# EAGLE design 528_Wio_Terminal_Rev010000 (EAGLE 9.6.2)
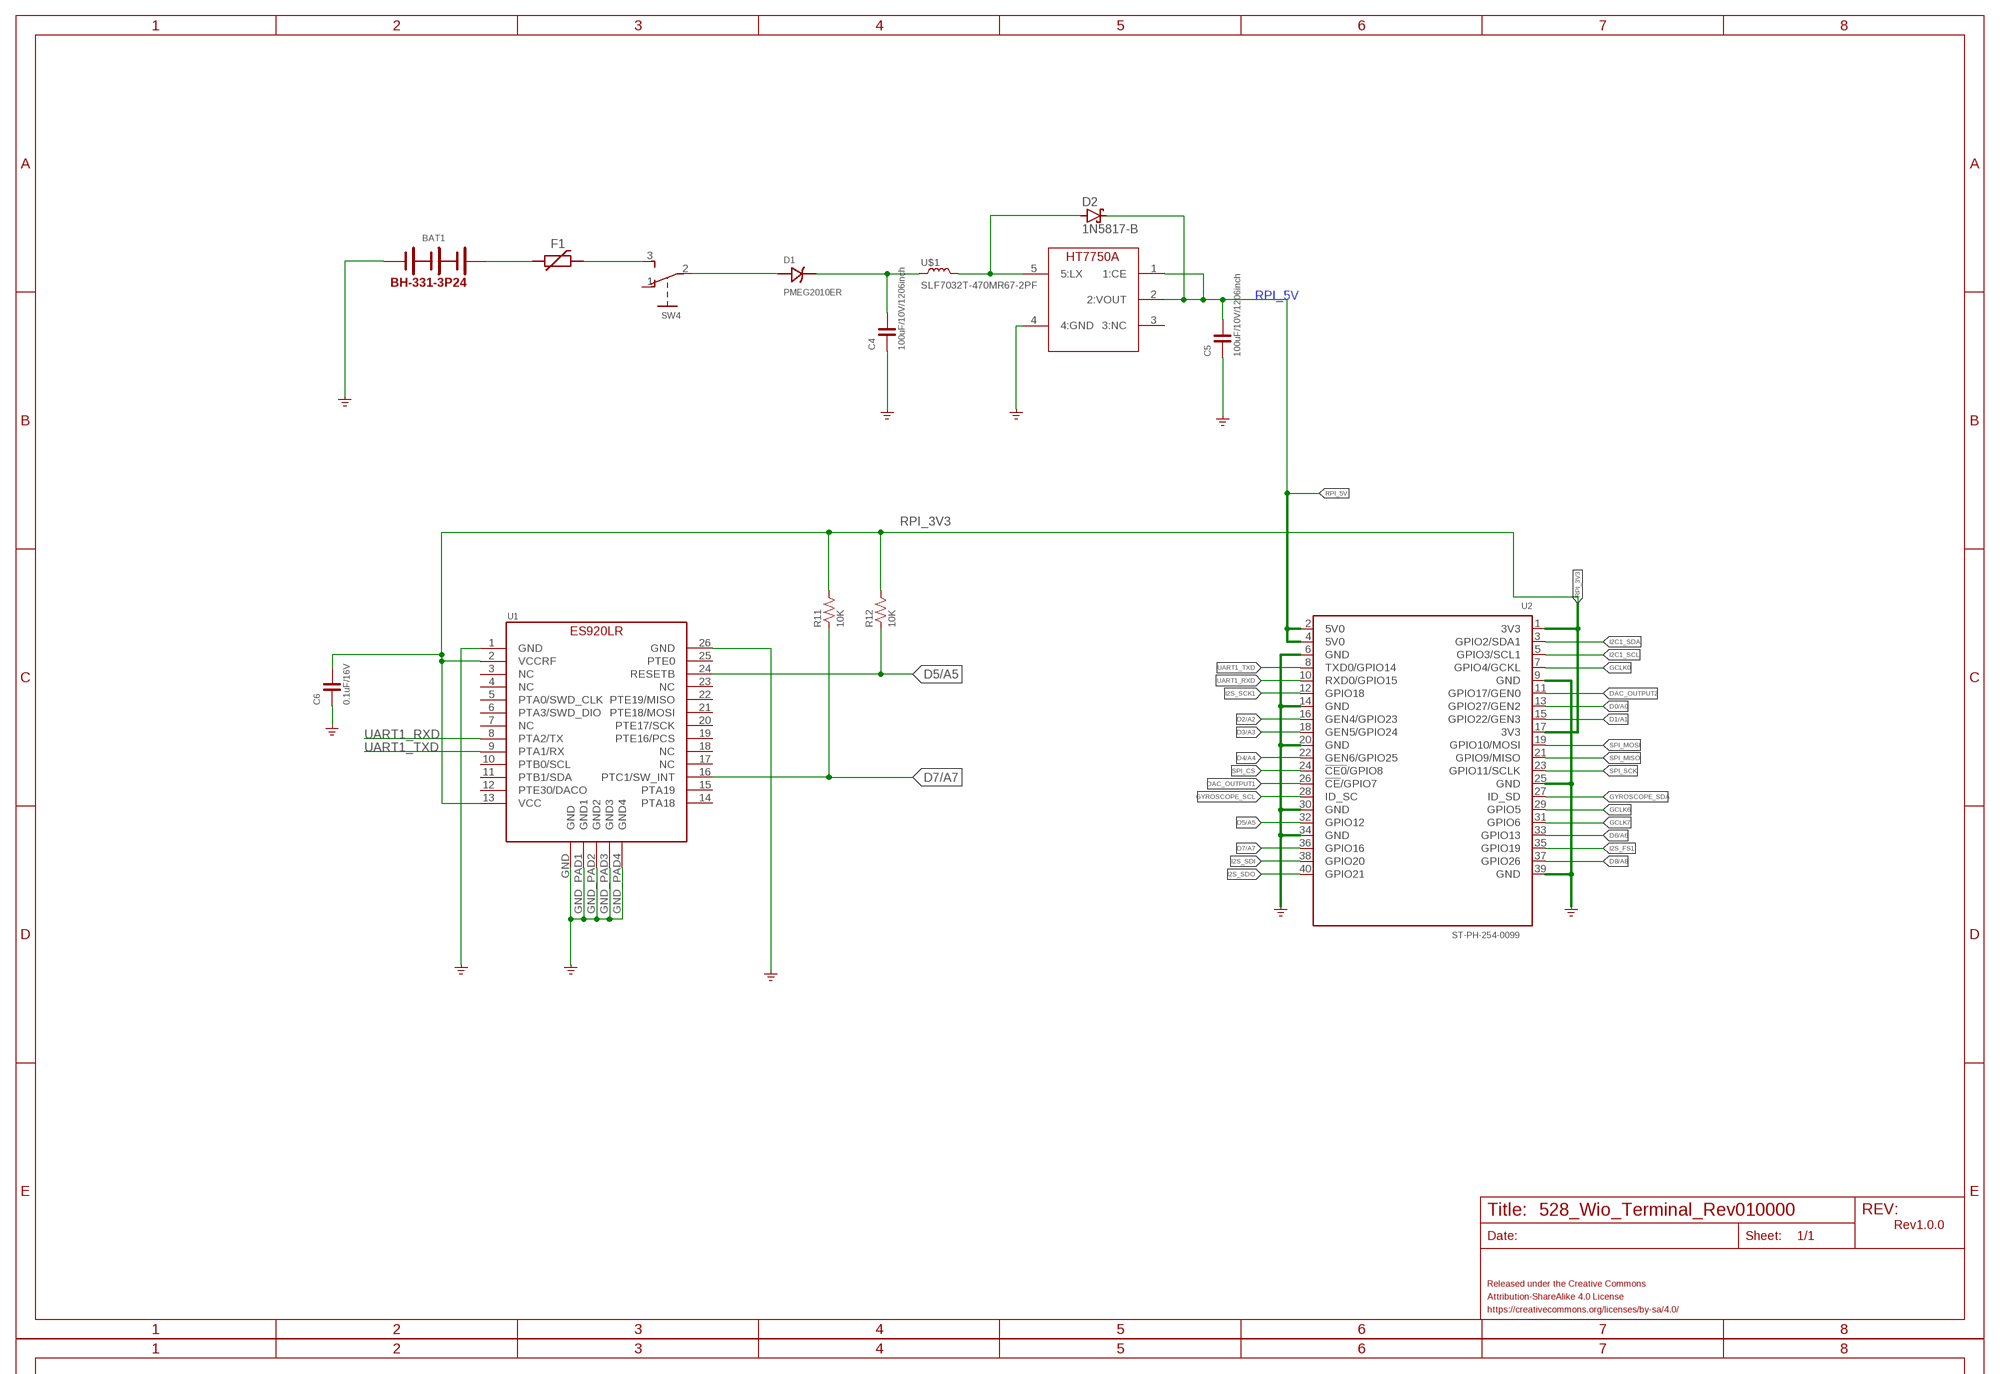
[diagram p0: schematic, sheet 1, part 1 of 2]
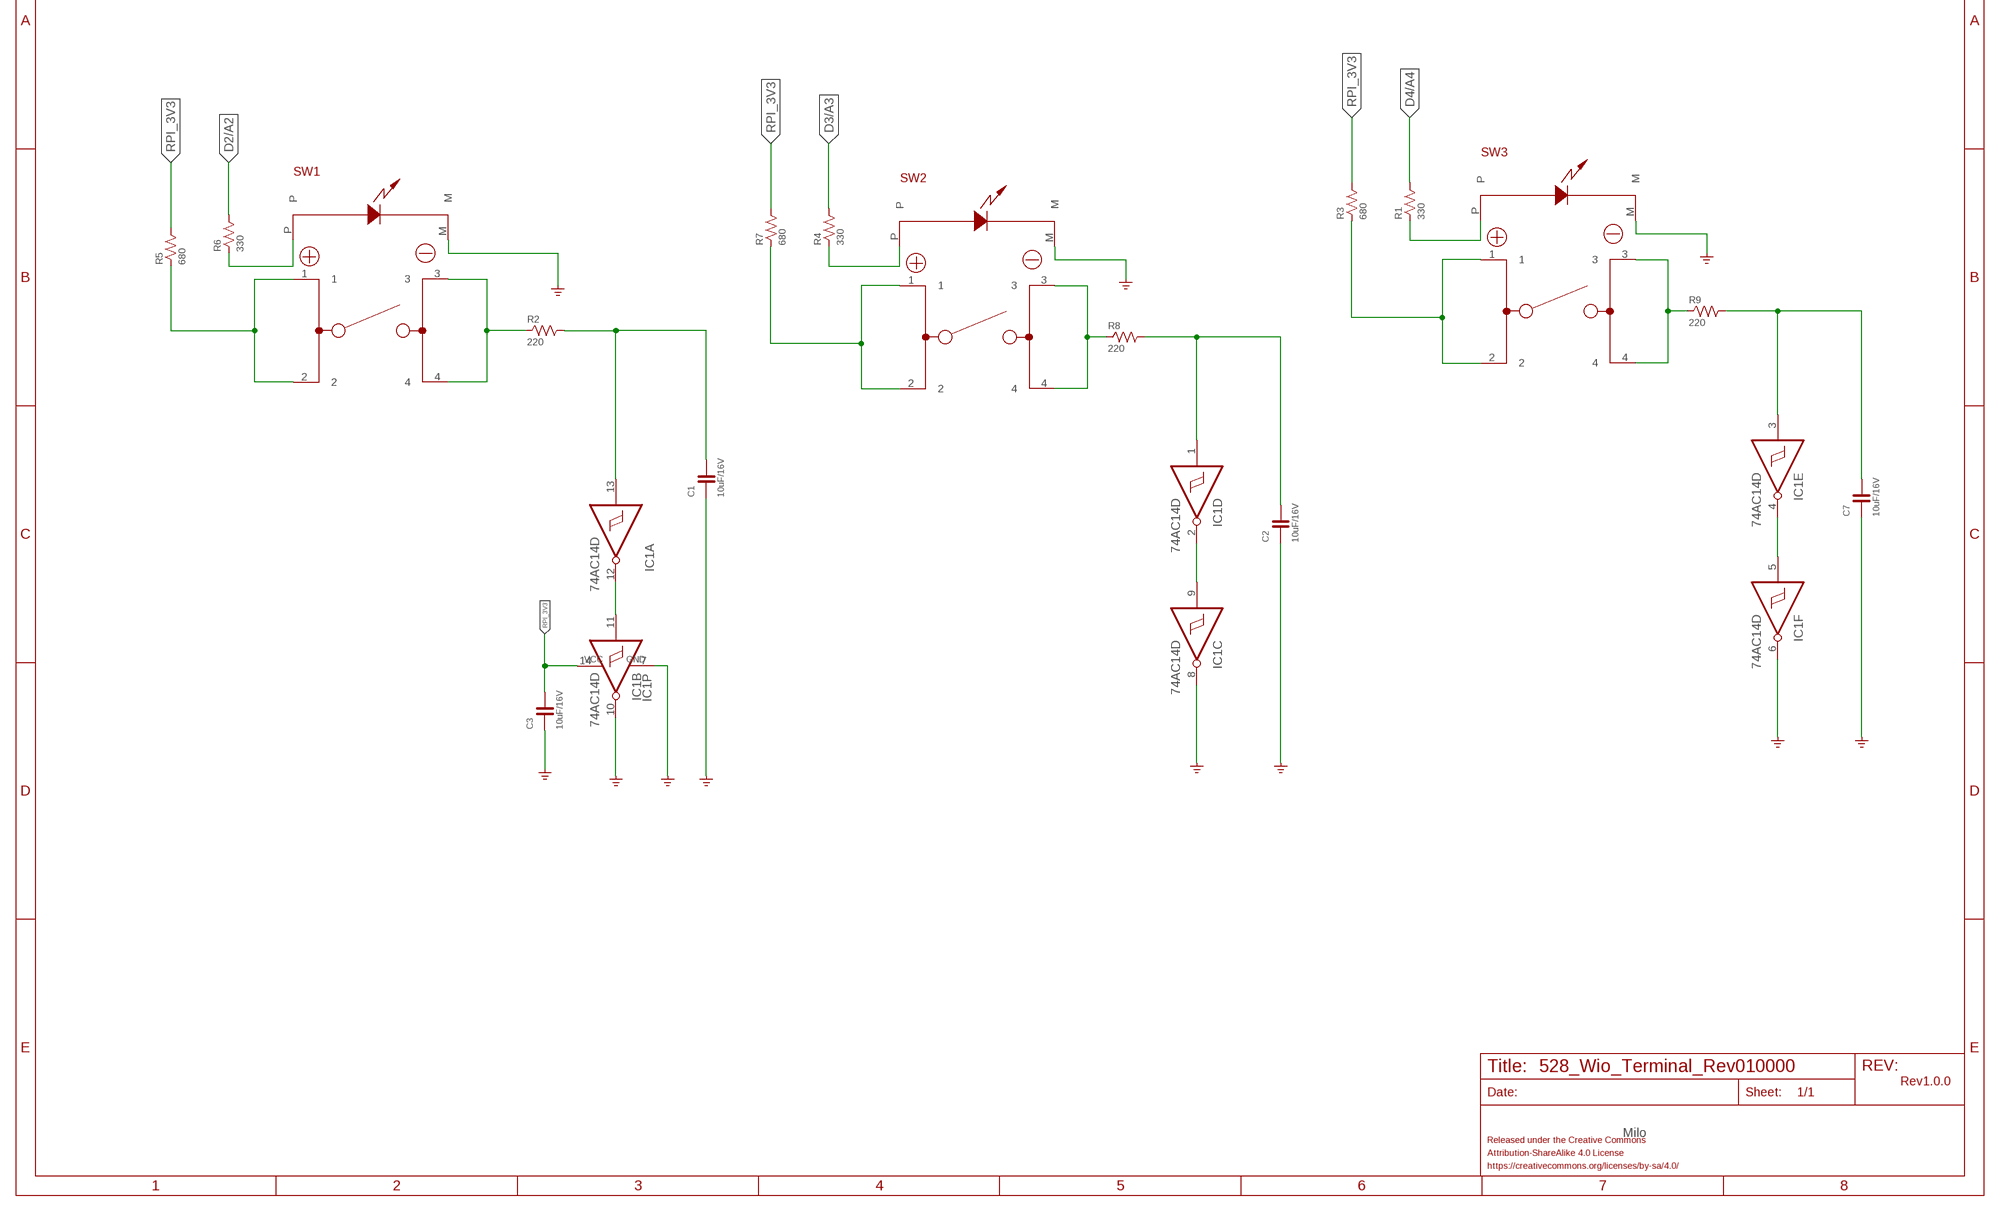
[diagram p1: schematic, sheet 1, part 2 of 2]

## Parts
BAT1  BH-331-3P24  [BH-331-3P24]
C1  10uF/16V  CAPACITOR-0603  [0603]
C2  10uF/16V  CAPACITOR-0603  [0603]
C3  10uF/16V  CAPACITOR-0603  [0603]
C4  100uF/10V/1206inch  CAPACITOR-1206  [1206]
C5  100uF/10V/1206inch  CAPACITOR-1206  [1206]
C6  0.1uF/16V  CAPACITOR-0603  [0603]
C7  10uF/16V  CAPACITOR-0603  [0603]
D1  PMEG2010ER  [SOD123W]
D2  1N5817-B  [DO41-7.6]
F1  POLYSWITCH1206  [1206]
IC1  74AC14D  [SO14]
R1  330  RESISTOR-0603  [0603]
R2  220  RESISTOR-0603  [0603]
R3  680  RESISTOR-0603  [0603]
R4  330  RESISTOR-0603  [0603]
R5  680  RESISTOR-0603  [0603]
R6  330  RESISTOR-0603  [0603]
R7  680  RESISTOR-0603  [0603]
R8  220  RESISTOR-0603  [0603]
R9  220  RESISTOR-0603  [0603]
R11  10K  RESISTOR-0603  [0603]
R12  10K  RESISTOR-0603  [0603]
SW1  LTM2-01-L2(RED)  [LTM2]
SW2  LTM2-01-L8(YELLOW)  [LTM2]
SW3  LTM2-01-L8(YELLOW)  [LTM2]
SW4  SLIDE-SSSS810701  [SSSS810701]
U1  ES920LR  [ES920LR]
U2  ST-PH-254-0099  RPI-ZERO-LONG  [H2X20-SMD-2.54-50.8X5MM-LONG]
U$1  SLF7032T-470MR67-2PF  [SLF7032T-470MR67-2PF]
U$2  HT7750A  [SOT-25]

## Nets
D0/A0: U2.13(GPIO27/GEN2)
D1/A1: U2.15(GPIO22/GEN3)
D2/A2: R6.2 U2.16(GEN4/GPIO23)
D3/A3: R4.2 U2.18(GEN5/GPIO24)
D4/A4: R1.2 U2.22(GEN6/GPIO25)
D5/A5: R12.1 U1.24(RESETB) U2.32(GPIO12)
D6/A6: U2.33(GPIO13)
D7/A7: R11.1 U1.16(PTC1/SW_INT) U2.36(GPIO16)
D8/A8: U2.37(GPIO26)
DAC_OUTPUT1: U2.26(!CE!/GPIO7)
DAC_OUTPUT2: U2.11(GPIO17/GEN0)
GCLK0: U2.7(GPIO4/GCKL)
GCLK6: U2.29(GPIO5)
GCLK7: U2.31(GPIO6)
GND: BAT1.MINUS C1.1 C2.1 C3.1 C4.2 C5.2 C6.1 C7.1 IC1.6(F:O) IC1.7(P:GND) IC1.8(C:O) IC1.10(B:O) SW1.M SW2.M SW3.M U1.1(GND) U1.26(GND) U1.GND U1.GND_PAD1(GND1) U1.GND_PAD2(GND2) U1.GND_PAD3(GND3) U1.GND_PAD4(GND4) U2.6(GND) U2.9(GND) U2.14(GND) U2.20(GND) U2.25(GND) U2.30(GND) U2.34(GND) U2.39(GND) U$2.4(4:GND) ; supply symbol labelled GND_POWER
GYROSCOPE_SCL: U2.28(ID_SC)
GYROSCOPE_SDA: U2.27(ID_SD)
I2C1_SCL: U2.5(GPIO3/SCL1)
I2C1_SDA: U2.3(GPIO2/SDA1)
I2S_FS1: U2.35(GPIO19)
I2S_SCK1: U2.12(GPIO18)
I2S_SDI: U2.38(GPIO20)
I2S_SDO: U2.40(GPIO21)
N$1: BAT1.PULS(PLUS) F1.1
N$2: C4.1 D1.1(CATHODE) U$1.1
N$3: D2.A U$1.2 U$2.5(5:LX)
N$4: R5.1 SW1.1 SW1.2
N$5: IC1.4(E:O) IC1.5(F:I)
N$6: R2.1 SW1.3 SW1.4
N$7: R9.1 SW3.3 SW3.4
N$8: IC1.11(B:I) IC1.12(A:O)
N$9: R6.1 SW1.P
N$10: R3.1 SW3.1 SW3.2
N$11: C1.2 IC1.13(A:I) R2.2
N$12: C3.2 IC1.14(P:VCC)
N$13: C7.2 IC1.3(E:I) R9.2
N$14: R1.1 SW3.P
N$15: C2.2 IC1.1(D:I) R8.2
N$16: IC1.2(D:O) IC1.9(C:I)
N$17: F1.2 SW4.3
N$18: R8.1 SW2.3 SW2.4
N$19: R7.1 SW2.1 SW2.2
N$20: D1.2(ANODE) SW4.2
N$25: R4.1 SW2.P
RPI_3V3: C6.2 R3.2 R5.2 R7.2 R11.2 R12.2 U1.2(VCCRF) U1.13(VCC) U2.1(3V3) U2.17(3V3)
RPI_5V: C5.1 D2.C U2.2(5V0) U2.4(5V0) U$2.1(1:CE) U$2.2(2:VOUT)
SPI_CS: U2.24(!CE0!/GPIO8)
SPI_MISO: U2.21(GPIO9/MISO)
SPI_MOSI: U2.19(GPIO10/MOSI)
SPI_SCK: U2.23(GPIO11/SCLK)
UART1_RXD: U1.8(PTA2/TX) U2.10(RXD0/GPIO15)
UART1_TXD: U1.9(PTA1/RX) U2.8(TXD0/GPIO14)
Unconnected: SW4.1 U1.3(NC) U1.4(NC) U1.5(PTA0/SWD_CLK) U1.6(PTA3/SWD_DIO) U1.7(NC) U1.10(PTB0/SCL) U1.11(PTB1/SDA) U1.12(PTE30/DACO) U1.14(PTA18) U1.15(PTA19) U1.17(NC) U1.18(NC) U1.19(PTE16/PCS) U1.20(PTE17/SCK) U1.21(PTE18/MOSI) U1.22(PTE19/MISO) U1.23(NC) U1.25(PTE0) U$2.3(3:NC)

## Notes on the sheet
- Rev1.0.0
- Rev1.0.0
- Milo

## Library data of the parts
BAT1 = FaBo-Battery:BH-331-3P24
C1-C3 C6 C7 = FaBo-Capacitor:CAPACITOR: CAPACITOR; SPICEPREFIX: C
C4 C5 = FaBo-Capacitor:CAPACITOR: CAPACITOR
D1 = FaBo-Diode:PMEG2010ER
D2 = diode:1N581*: 1.0A SCHOTTKY BARRIER RECTIFIER Source: http://www.diodes.com/datasheets/ds23001.pdf
F1 = FaBo-Supply:POLYSWITCH
IC1 = 74xx-eu:74*14: Hex schmitt trigger INVERTER; SPICEPREFIX: I
R1-R9 R11 R12 = FaBo-Resistors:RESISTOR: RESISTOR; SPICEPREFIX: R
SW1 = FaBo-Switch:LTM2-01-L2(RED): FUJISOKU SWITCHS LTM2 SPST with LED Swtich Function OFF-(ON) LTM 1VA Max,DC 48V ELECTRICAL LIFE 300,000 Operations BOUNCE 10m Sec TRAVEL 0.25mm; SPICEPREFIX: X
SW2 SW3 = FaBo-Switch:LTM2-01-L8(YELLOW): FUJISOKU SWITCHS LTM2 SPST with LED Swtich Function OFF-(ON) LTM 1VA Max,DC 48V ELECTRICAL LIFE 300,000 Operations BOUNCE 10m Sec TRAVEL 0.25mm
SW4 = FaBo-Switch:SLIDE: EG1218 E-SWICTH Series EG-Swicthes <https://www.e-switch.com/system/asset/product_line/data_sheet/119/EG.pdf> Distributor SSSS810701 Alps SSSS8 Series <http://www.alps.com/prod/info/J/HTML/Switch/Slide/SSSS8/SSSS810701.html> Octoatrs <https://octopart.com/search?q=SSSS810701+>
U1 = FaBo-LoRa:ES920LR
U2 = moudle-new:RPI-ZERO
U$1 = FaBo-Coil:SLF7032T-470MR67-2PF: TDK SLF7032 Inductors for power circuits 7.0-7.0-3.2
U$2 = FaBo-Supply:HT7750A

## Board
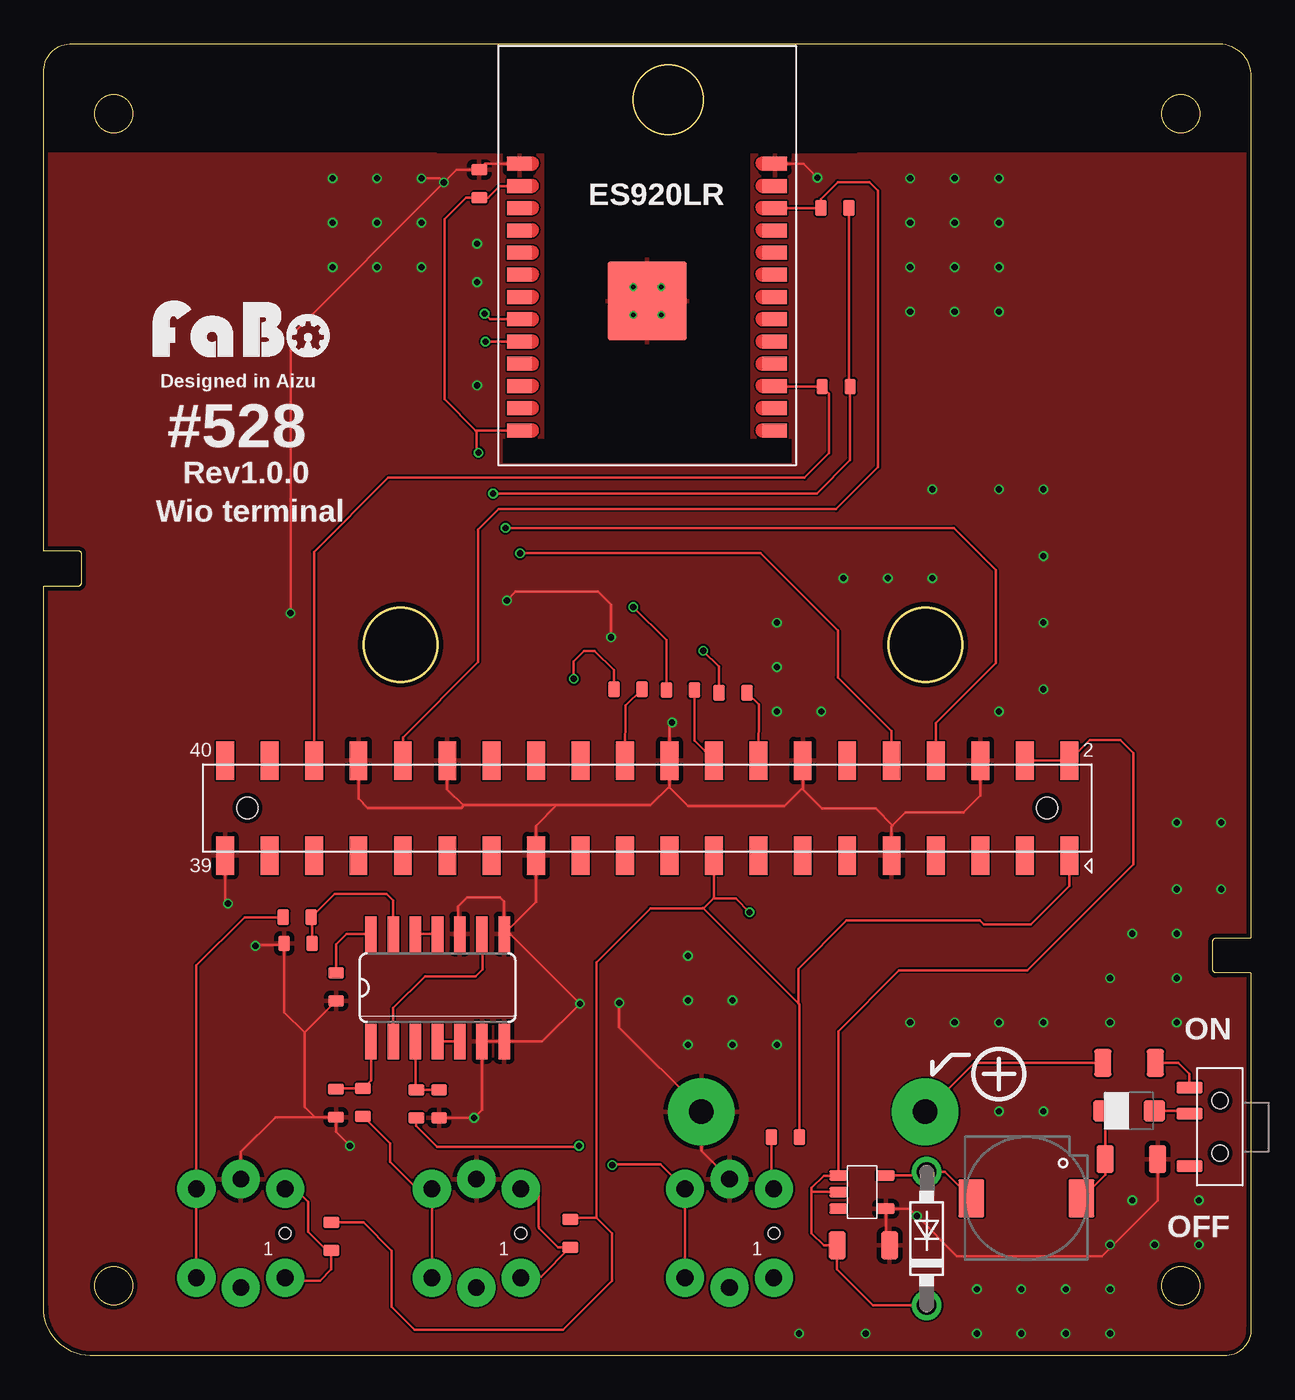
[diagram p2: board, top side]
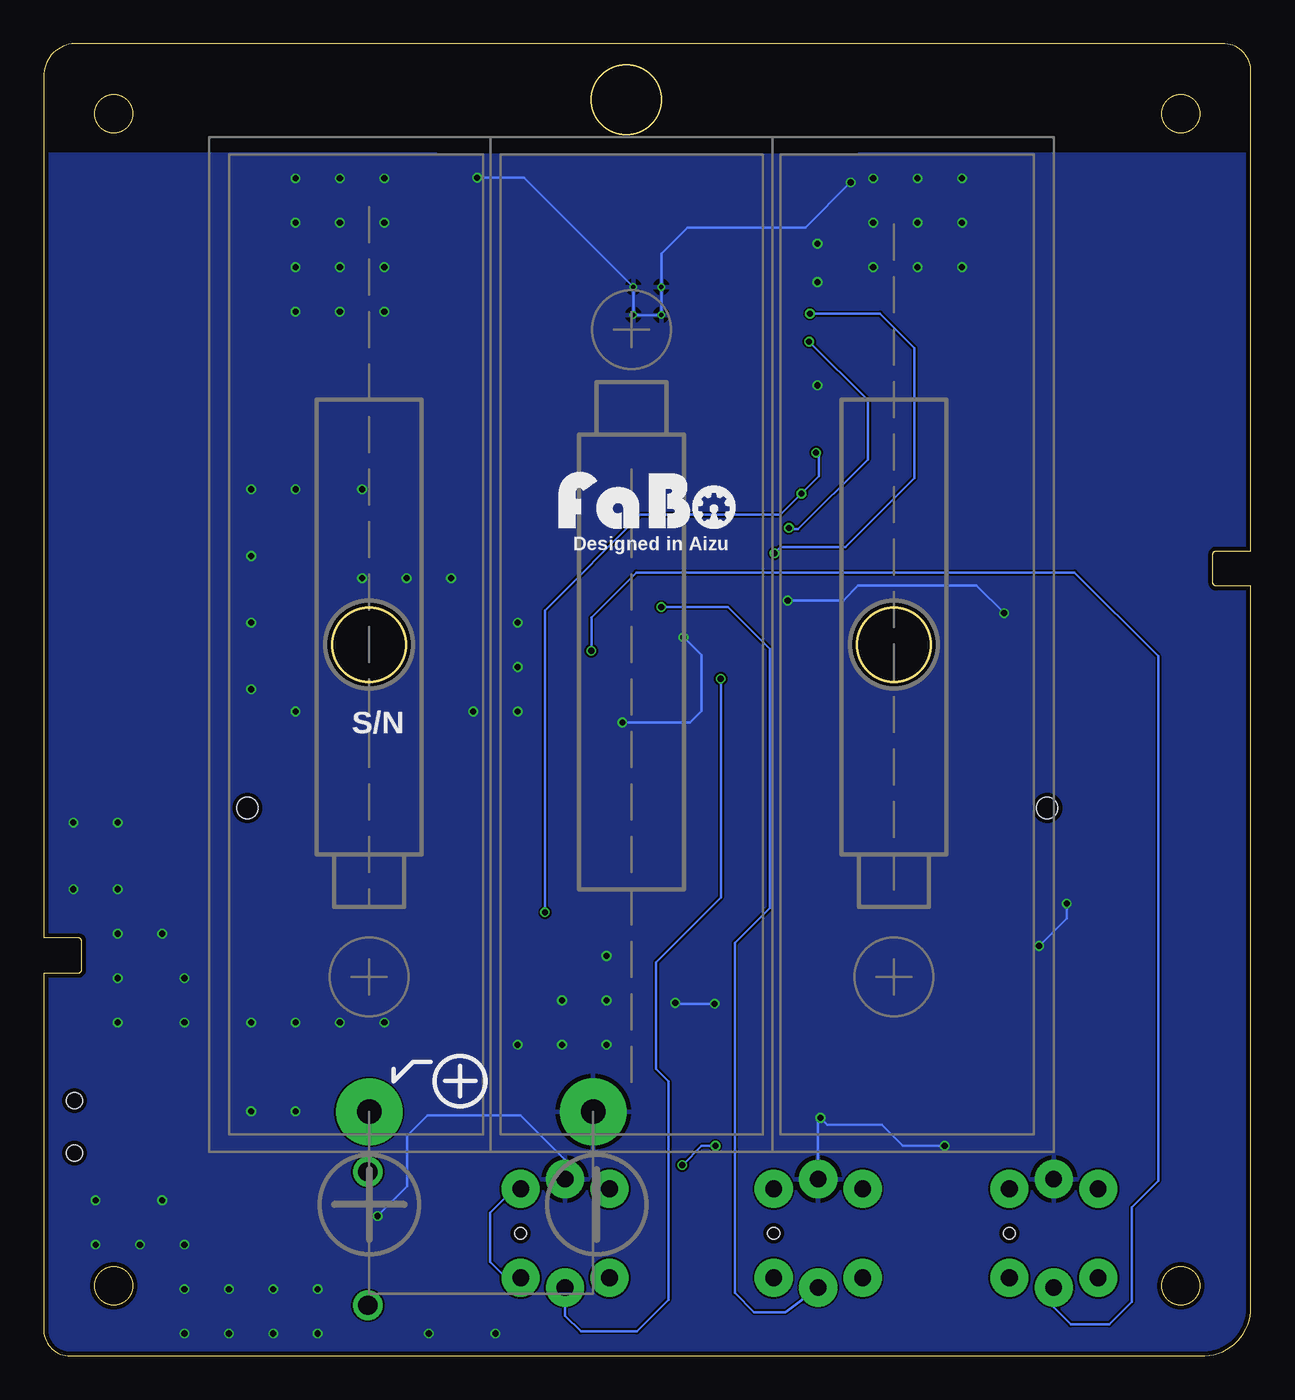
[diagram p3: board, bottom side, seen from below]

Size 69 x 75 mm. Coordinates in mm from the lower left corner, seen from the top.
Outline: 67.63,0 2.64,0 arc-90 0,2.79 0,44 2,44 arc90 2.16,44.23 2.16,45.85 arc90 2,46 0,46 0,73.36 arc-90 1.48,75 67.06,75 arc-90 69,73.28 69,23.88 67,23.88 arc90 66.84,23.73 66.84,22.1 arc90 67,21.88 69,21.88 69,1.57 arc-90 67.63,0
Outline: circle at 65,71 radius 1.1
Outline: circle at 4,71 radius 1.1
Outline: circle at 4,4 radius 1.1
Outline: circle at 65,4 radius 1.1
Copper layers (1*16): Top 0.035mm / dielectric 0.2mm / Bottom 0.035mm
Design rules "SeeedStudio_4layer_DRU_no_angle_20140221 *": minimum track width 1mil, minimum drill 10mil, track to track 4mil, track to pad 4mil, pad to pad 4mil, via to via 4mil, smd to smd 0mil, copper to edge 10mil, drill to drill 8mil, minimum pad ring 4mil, minimum via ring 4mil, stop-mask expansion 2mil, vias tented up to drill 25mil, thermal gap 10mil
tRestrict: area -10.4,68.8 to 77,84.7
bRestrict: area -10.4,68.8 to 77,84.7

### Footprints (pad centres in the part's own frame; a part is rotated, then mirrored left to right if it is on the bottom)
BH-331-3P24 = drill 1.4 pad 3.81: MINUS 26.7,-2.2; PULS 26.7,-15
0603 = smd 0.65 x 0.9: 1 -0.8,0; 2 0.8,0
1206 = smd 1 x 1.6: 1 -1.5,0; 2 1.5,0
SOD123W = smd 1.2 x 1.2: 1 -1.45,0; 2 1.45,0
DO41-7.6 = drill 1.1 pad 1.7: A 3.81,0; C -3.81,0
SO14 = smd 0.66 x 2.032: 1 -3.81,-3.073; 2 -2.54,-3.073; 3 -1.27,-3.073; 4 0,-3.073; 5 1.27,-3.073; 6 2.54,-3.073; 7 3.81,-3.073; 8 3.81,3.073; 9 2.54,3.073; 10 1.27,3.073; 11 0,3.073; 12 -1.27,3.073; 13 -2.54,3.073; 14 -3.81,3.073
LTM2 = drill 0.95 pad 2.184: 1 2.54,-2.54; 2 2.54,2.54; 3 -2.54,-2.54; 4 -2.54,2.54; M 0,3.1; P 0,-3.1 | hole 0.65: 2.54,0
SSSS810701 = smd 0.7 x 1.5: 1 -2.25,1.75; 2 0.75,1.75; 3 2.25,1.75 | hole 0.9: -1.5,0; 1.5,0
ES920LR = smd 1.4 x 0.8: 1 -7.3,5.24; 2 -7.3,3.97; 3 -7.3,2.7; 4 -7.3,1.43; 5 -7.3,0.16; 6 -7.3,-1.11; 7 -7.3,-2.38; 8 -7.3,-3.65; 9 -7.3,-4.92; 10 -7.3,-6.19; 11 -7.3,-7.46; 12 -7.3,-8.73; 13 -7.3,-10; 14 7.3,-10; 15 7.3,-8.73; 16 7.3,-7.46; 17 7.3,-6.19; 18 7.3,-4.92; 19 7.3,-3.65; 20 7.3,-2.38; 21 7.3,0.16; 22 7.3,-1.11; 23 7.3,1.43; 24 7.3,2.7; 25 7.3,3.97; 26 7.3,5.24 | smd 4.5 x 4.5: GND 0,-2.6 | drill 0.25: GND_PAD1 -0.8,-1.8; GND_PAD2 0.8,-1.8; GND_PAD3 -0.8,-3.4; GND_PAD4 0.8,-3.4
H2X20-SMD-2.54-50.8X5MM-LONG = smd 1.02 x 2.2 bottom: 1 -24.13,-2.715; 2 -24.13,2.715; 3 -21.59,-2.715; 4 -21.59,2.715; 5 -19.05,-2.715; 6 -19.05,2.715; 7 -16.51,-2.715; 8 -16.51,2.715; 9 -13.97,-2.715; 10 -13.97,2.715; 11 -11.43,-2.715; 12 -11.43,2.715; 13 -8.89,-2.715; 14 -8.89,2.715; 15 -6.35,-2.715; 16 -6.35,2.715; 17 -3.81,-2.715; 18 -3.81,2.715; 19 -1.27,-2.715; 20 -1.27,2.715; 21 1.27,-2.715; 22 1.27,2.715; 23 3.81,-2.715; 24 3.81,2.715; 25 6.35,-2.715; 26 6.35,2.715; 27 8.89,-2.715; 28 8.89,2.715; 29 11.43,-2.715; 30 11.43,2.715; 31 13.97,-2.715; 32 13.97,2.715; 33 16.51,-2.715; 34 16.51,2.715; 35 19.05,-2.715; 36 19.05,2.715; 37 21.59,-2.715; 38 21.59,2.715; 39 24.13,-2.715; 40 24.13,2.715 | hole 1.2: -22.86,0; 22.86,0
SLF7032T-470MR67-2PF = smd 1.5 x 2.2: 1 -3.15,0; 2 3.15,0
SOT-25 = smd 0.6 x 1.05: 1 -0.95,-1.35; 2 0,-1.35; 3 0.95,-1.35; 4 0.95,1.35; 5 -0.95,1.35

### Placement (x,y rotation side)
BAT1  35.4,40.65 270 bottom
C1  14.54,23.57 0 top
C2  16.7,14.44 90 top
C3  16.72,21.09 90 top
C4  62.17,11.24 0 top
C5  46.86,6.31 0 top
C6  24.9,67 270 top
C7  22.6,14.4 90 top
D1  62.04,14 0 top
D2  50.48,6.7 90 top
F1  62.05,16.75 0 top
IC1  22.51,21.04 0 top
R1  33.4,38.1 0 top
R2  14.5,25.07 0 top
R3  42.4,12.5 0 top
R4  36.4,38.05 0 top
R5  16.44,6.83 90 top
R6  39.41,37.89 0 top
R7  30.09,7 90 top
R8  18.25,14.49 90 top
R9  21.3,14.4 90 top
R11  45.3,55.4 0 top
R12  45.23,65.62 0 top
SW1  11.26,7 0 top
SW2  24.73,7 0 top
SW3  39.2,7 0 top
SW4  67.24,13.08 90 top
U1  34.5,62.9 0 top
U2  34.5,31.31 0 bottom
U$1  56.17,9 180 top
U$2  46.78,9.36 270 top
U$3  [LOGO_FABO_M]  11.3,56.7 0 top
U$4  [LOGO_FABO_M]  34.5,46.9 0 bottom

### Tracks (layer width: path | path; a pad name or v marks a point on that pad's centre or on a via)
D2/A2
  Top 0.152: U2.16 40.88,37.23 R6.2
D3/A3
  Top 0.152: U2.18 37.2,35.17 R4.2
D4/A4
  Top 0.152: U2.22 33.26,37.16 R1.2
D5/A5
  Top 0.152: U2.32 20.53,35.35 24.83,39.65 24.83,47.23 26,48.4 45.3,48.4 47.7,50.8 47.7,66.6 47.2,67.1 45.4,67.1 44.43,66.12 R12.1 44.4,65.6 U1.24
D7/A7
  Top 0.152: U1.16 41.84,55.4 R11.1 44.9,55 44.9,51.6 43.5,50.2 19.7,50.2 15.45,45.95 U2.36
GND  (via drill 0.35)
  Top 0.152: C5.2 48.13,6.54 U$2.4 49.49,8.41 v49.91,7.99 52.2,5.7 60.5,5.7 63.67,8.87 C4.2 | IC1.8 26.32,25.98 26.1,26.2 24.2,26.2 23.7,25.7 23.7,24.2 IC1.10 | 15.5,13.64 C2.1 16.7,12.8 v17.5,12 | 15.5,13.64 13.24,13.64 11.26,11.66 SW1.M | C7.1 v24.6,13.6 25.05,14.05 IC1.6 IC1.7 28.49,17.96 v30.65,20.12 26.66,24.11 IC1.8 | SW3.M 37.6,11.71 BAT1.MINUS 37.6,14.08 32.9,18.77 v32.9,20.18 | U2.9 48.47,30.27 48.53,30.32 | U2.6 53.55,32.02 52.58,31.05 49.25,31.05 48.53,30.32 | U2.14 43.39,32.48 | 43.39,32.48 43.39,32.36 44.48,31.27 47.58,31.27 48.53,30.32 | 35.77,32.55 U2.20 35.77,36.05 v35.93,36.2 | 35.77,32.55 35.77,32.48 36.83,31.43 42.34,31.43 43.39,32.48 | IC1.8 28.15,25.94 U2.25 28.15,30.3 29.33,31.48 | 35.77,32.55 34.7,31.48 29.33,31.48 | 29.33,31.48 24.03,31.48 24,31.45 | 24,31.45 23.07,32.38 U2.30 | U2.34 17.99,31.86 18.53,31.32 23.88,31.32 24,31.45 | U1.1 25.24,68.14 C6.1 23.6,67.8 v22.88,67.08 | v44.23,67.35 43.44,68.14 U1.26 | C3.1 14.9,18.48 | 15.5,13.64 14.9,14.24 14.9,18.48 | C1.1 13.74,23.5 | 13.74,23.5 13.74,19.63 14.9,18.48 | U2.39 10.37,26 v10.53,25.85 | v12.1,23.43 12.18,23.5 13.74,23.5 | v32.43,41.08 32.43,42.95 31.7,43.67 26.98,43.67 v26.48,43.17 | v14.1,42.45 14.1,58.3 v22.88,67.08 | U1.GND U1.GND_PAD2 | v22.88,67.08 22.64,67.31 v21.59,67.31
  Bottom 0.152: SW2.M 24.73,13.47 v24.6,13.6 24.2,13.2 21.08,13.2 19.88,12 v17.5,12 | v22.88,67.08 25.45,64.5 32.2,64.5 33.7,63 U1.GND_PAD1 U1.GND_PAD3 U1.GND_PAD4 U1.GND_PAD2 41.55,67.35 v44.23,67.35 | v32.9,20.18 32.85,20.12 v30.65,20.12 | v10.53,25.85 10.53,25 v12.1,23.43 | v35.93,36.2 32.05,36.2 31.4,36.85 31.4,40.05 v32.43,41.08 | v26.48,43.17 23.3,43.17 22.45,44.02 15.68,44.02 v14.1,42.45 | SW3.M 39.2,11.2 41.75,13.75 47.05,13.75 48.23,12.57 48.23,9.68 v49.91,7.99
  other vias: 24.78,63.58 24.78,61.38 24.78,55.48 19.05,67.31 16.51,67.31 16.51,64.77 19.05,64.77 19.05,62.23 16.51,62.23 21.59,62.23 21.59,64.77 49.53,67.31 49.53,64.77 52.07,64.77 52.07,67.31 54.61,67.31 54.61,64.77 49.53,62.23 52.07,62.23 54.61,62.23 55.88,3.81 55.88,1.27 58.42,1.27 58.42,3.81 60.96,3.81 60.96,1.27 53.34,1.27 53.34,3.81 63.5,6.35 60.96,6.35 62.23,8.89 66.04,6.35 66.04,8.89 46.99,1.27 43.18,1.27 54.61,13.97 57.15,13.97 57.15,19.05 54.61,19.05 52.07,19.05 49.53,19.05 60.96,19.05 64.77,19.05 64.77,21.59 60.96,21.59 64.77,24.13 62.23,24.13 64.77,26.67 67.31,26.67 67.31,30.48 64.77,30.48 44.45,36.83 41.91,36.83 41.91,39.37 41.91,41.91 45.72,44.45 48.26,44.45 50.8,44.45 50.8,49.53 54.61,49.53 57.15,49.53 57.15,45.72 57.15,41.91 57.15,38.1 49.53,59.69 52.07,59.69 54.61,59.69 54.61,36.83 36.83,17.78 36.83,20.32 39.37,20.32 39.37,17.78 41.91,17.78 36.83,22.86
  pour Bottom: -4.6,83.1 74.8,83.1 74.8,-4.7 -4.6,-4.7
  pour Top: -4.6,83.8 74.2,83.8 74.2,-5.8 -4.6,-5.8
N$1
  Top 0.152: BAT1.PULS 53.2,16.75 F1.1
N$2
  Top 0.152: C4.1 60.51,11.4 | U$1.1 60.67,10.36 C4.1 | C4.1 60.67,13.91 D1.1
N$3
  Top 0.152: U$1.2 51.51,10.51 D2.A 50.28,10.31 U$2.5
N$4
  Top 0.152: SW1.1 13.9,4.3 15.8,4.3 16.44,4.94 R5.1 16.18,6.03 15.1,7.1 15.1,8.8 14.42,9.48 SW1.2
N$5
  Top 0.152: IC1.4 IC1.5
N$6
  Top 0.152: R2.1 11.47,25.07 8.72,22.32 8.72,9.6 SW1.4 SW1.3
N$7  (via drill 0.35)
  Top 0.152: R9.1 21.3,13.15 22.5,11.95 30.55,11.95 v30.6,12 | v32.5,10.9 32.54,10.94 35.26,10.94 SW3.4 SW3.3
  Bottom 0.152: v30.6,12 31.4,12 v32.5,10.9
N$8
  Top 0.152: IC1.11 IC1.12
N$9  (via drill 0.35)
  Top 0.152: R6.1 38.61,39.39 v37.7,40.3
  Bottom 0.152: v37.7,40.3 37.7,42.2 35.13,44.77 10.08,44.77 5.3,40 5.3,10 6.8,8.5 6.8,3.1 8.1,1.8 10.3,1.8 11.26,2.76 SW1.P
N$10
  Top 0.152: R3.1 41.6,9.68 SW3.2
  Bottom 0.152: SW3.2 42.11,9.54 43.48,8.18 43.48,5.38 42.56,4.46 SW3.1
N$11
  Top 0.152: IC1.13 19.97,26.03 19.6,26.4 16.63,26.4 15.36,25.14 15.34,25.12 | 15.34,25.12 R2.2 | C1.2 15.34,25.12
N$12
  Top 0.152: C3.2 16.72,23.52 17.31,24.11 IC1.14
N$13
  Top 0.152: IC1.3 21.24,15.26 R9.2 C7.2
N$14  (via drill 0.35)
  Top 0.152: R1.1 32.6,39.2 31.5,40.3 30.9,40.3 30.3,39.7 v30.3,38.7
  Bottom 0.152: v30.3,38.7 30.3,26.2 34,22.5 34,16.4 33.3,15.7 33.3,3.2 35.1,1.4 38.3,1.4 39.2,2.3 SW3.P
N$15
  Top 0.152: IC1.1 18.7,15.74 R8.2 16.75,15.29 C2.2
N$16
  Top 0.152: IC1.2 19.97,19.87 21.8,21.7 24.7,21.7 25.1,22.1 25.1,24.07 IC1.9
N$17
  Top 0.152: F1.2 64.85,16.75 65.49,16.11 SW4.3
N$18
  Top 0.152: R8.1 19.8,12.13 19.8,11.1 21.29,9.61 SW2.4 SW2.3
N$19
  Top 0.152: SW2.1 28.43,4.53 R7.1 29.41,6.2 28.32,7.28 28.32,7.34 28.3,7.36 28.3,9.2 27.89,9.61 SW2.2
N$20
  Top 0.152: D1.2 65.32,14 SW4.2
N$25  (via drill 0.35)
  Top 0.152: R4.1 35.6,40.9 v33.7,42.8
  Bottom 0.152: SW2.P 26.59,2.5 28.4,2.5 29.5,3.6 29.5,23.6 27.5,25.6 27.5,40.4 29.9,42.8 v33.7,42.8
RPI_3V3  (via drill 0.35)
  Top 0.152: R3.2 43.2,20.1 43.15,20.15 | 43.15,20.15 37.73,25.57 | 37.73,25.57 37.7,25.6 | R7.2 30.09,7.9 31.59,7.9 | 31.59,7.9 31.59,22.5 34.67,25.57 37.73,25.57 | R5.2 18.28,7.62 19.9,6 19.9,2.8 21.2,1.5 29.7,1.5 32.5,4.3 32.5,7 31.6,7.9 31.59,7.9 | 37.73,25.57 38.29,26.14 | 38.29,26.14 38.31,26.16 U2.17 | U1.2 26.07,66.87 25.4,66.2 C6.2 24.15,66.2 22.93,64.97 22.93,54.67 24.7,52.9 | U1.13 24.7,52.9 | 43.15,20.15 43.15,22.12 45.9,24.88 53.53,24.88 53.75,24.65 56.43,24.65 58.63,26.86 U2.1 | 38.29,26.14 39.56,26.14 v40.35,25.35 | v24.85,51.62 24.75,51.73 24.75,52.85 24.7,52.9 | R12.2 46.03,55.48 R11.2 46.1,51.2 44.19,49.29 v25.69,49.29
  Bottom 0.152: v40.35,25.35 40.35,42.6 34.88,48.08 26.9,48.08 v25.69,49.29 24.7,50.27 24.7,51.48 v24.85,51.62
RPI_5V
  Top 0.152: 45.43,10.2 U$2.1 | U$2.1 45.43,18.56 48.9,22.02 56.23,22.02 62.3,28.1 62.3,34.45 61.55,35.2 59.81,35.2 U2.2 U2.4 | D2.C 47.41,2.89 45.36,4.94 C5.1 44.59,6.31 43.9,7 43.9,9.3 | 43.9,9.3 43.9,9.6 44.6,10.3 U$2.1 | U$2.2 43.96,9.36 43.9,9.3
UART1_RXD  (via drill 0.35)
  Top 0.152: U1.8 25.53,59.25 v25.2,59.58 | v27.23,45.88 40.98,45.88 45.4,41.45 45.4,38.77 48.47,35.7 U2.10
  Bottom 0.152: v25.2,59.58 21.2,59.58 19.23,57.6 19.23,50.17 23.18,46.23 26.88,46.23 v27.23,45.88
UART1_TXD  (via drill 0.35)
  Top 0.152: U1.9 v25.26,57.98 v25.25,57.98 | v26.4,47.33 52.03,47.33 54.43,44.92 54.43,39.6 51.01,36.19 U2.8
  Bottom 0.152: v25.25,57.98 21.9,54.62 21.9,51.23 25.88,47.25 26.33,47.25 v26.4,47.33

### Text on the board
tPlace: ES920LR | Designed in Aizu | #528 | Rev1.0.0 | Wio terminal | ON | OFF
bPlace: Designed in Aizu | S/N
Document: #528 Wio terminal Rev1.0.0 / 2022/07/19
tDocu: 40PIN_HEADER SMT | RED | YELLOW | GREEN